# EAGLE design vertical_farming (EAGLE 9.6.2)
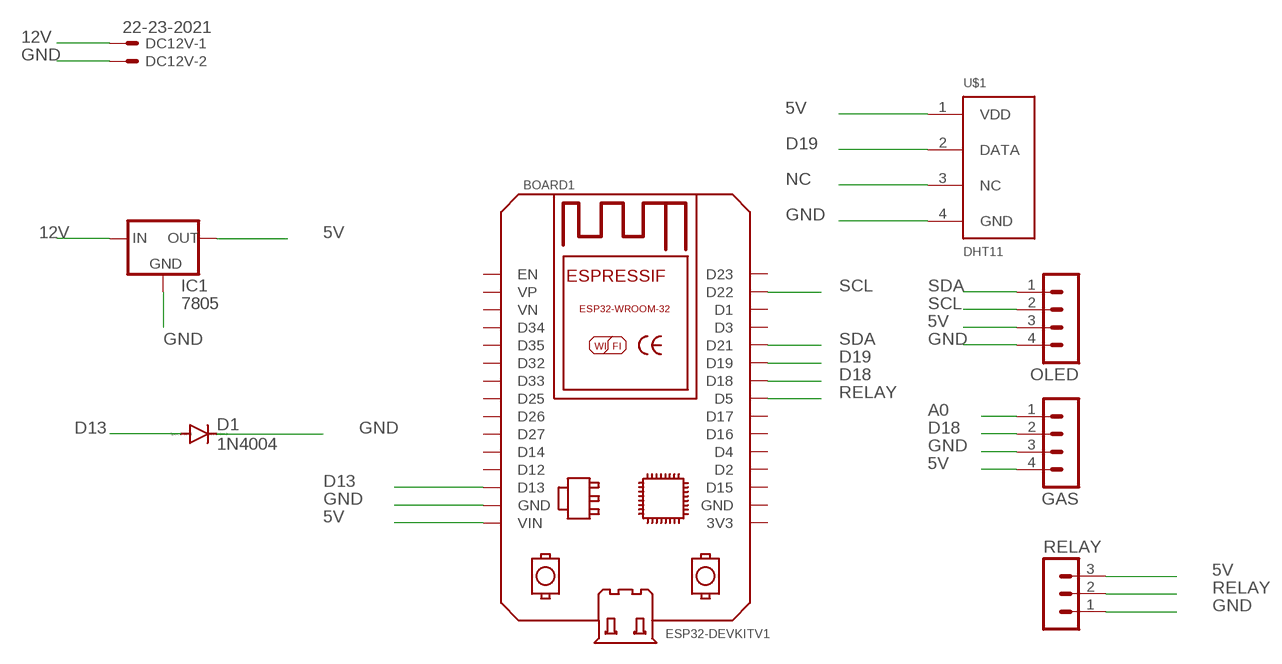
[diagram p0: schematic, sheet 1]

## Parts
BOARD1  ESP32DEVKITV1  [ESP32-DEVKITV1]
D1  1N4004  [DO41-10]
DC12V  22-23-2021  [22-23-2021]
GAS  MA04-1  [MA04-1]
IC1  7805  78XXL  [78XXL]
OLED  MA04-1  [MA04-1]
RELAY  MA03-1  [MA03-1]
U$1  DHT11  [DHT11]

## Nets
5V: BOARD1.VIN GAS.4 IC1.OUT OLED.3 RELAY.3 U$1.1(VDD)
12V: DC12V.1 IC1.IN
A0: GAS.1
D13: BOARD1.D13 D1.A
D18: BOARD1.D18 GAS.2
D19: BOARD1.D19 U$1.2(DATA)
GND: BOARD1.GND D1.C DC12V.2 GAS.3 IC1.GND OLED.4 RELAY.1 U$1.4(GND)
NC: U$1.3(NC)
RELAY: BOARD1.D5 RELAY.2
SCL: BOARD1.D22 OLED.2
SDA: BOARD1.D21 OLED.1
Unconnected: BOARD1.3V3 BOARD1.D1 BOARD1.D2 BOARD1.D3 BOARD1.D4 BOARD1.D12 BOARD1.D14 BOARD1.D15 BOARD1.D16 BOARD1.D17 BOARD1.D23 BOARD1.D25 BOARD1.D26 BOARD1.D27 BOARD1.D32 BOARD1.D33 BOARD1.D34 BOARD1.D35 BOARD1.EN BOARD1.GND@1(GND) BOARD1.VN BOARD1.VP

## Library data of the parts
BOARD1 = ESP32-DEVKITV1:ESP32DEVKITV1: https://github.com/shridattdudhat
D1 = diode:1N4004: DIODE general purpose rectifier, 1 A
DC12V = con-molex:22-23-2021: .100" (2.54mm) Center Header - 2 Pin; MF: MOLEX; MPN: 22-23-2021; OC_FARNELL: 1462926; OC_NEWARK: 25C3832
GAS OLED = con-lstb:MA04-1: PIN HEADER; OC_FARNELL: unknown; OC_NEWARK: unknown
IC1 = v-reg:78XXL: VOLTAGE REGULATOR
RELAY = con-lstb:MA03-1: PIN HEADER; OC_FARNELL: unknown; OC_NEWARK: unknown
U$1 = dht:DHT11

## Board
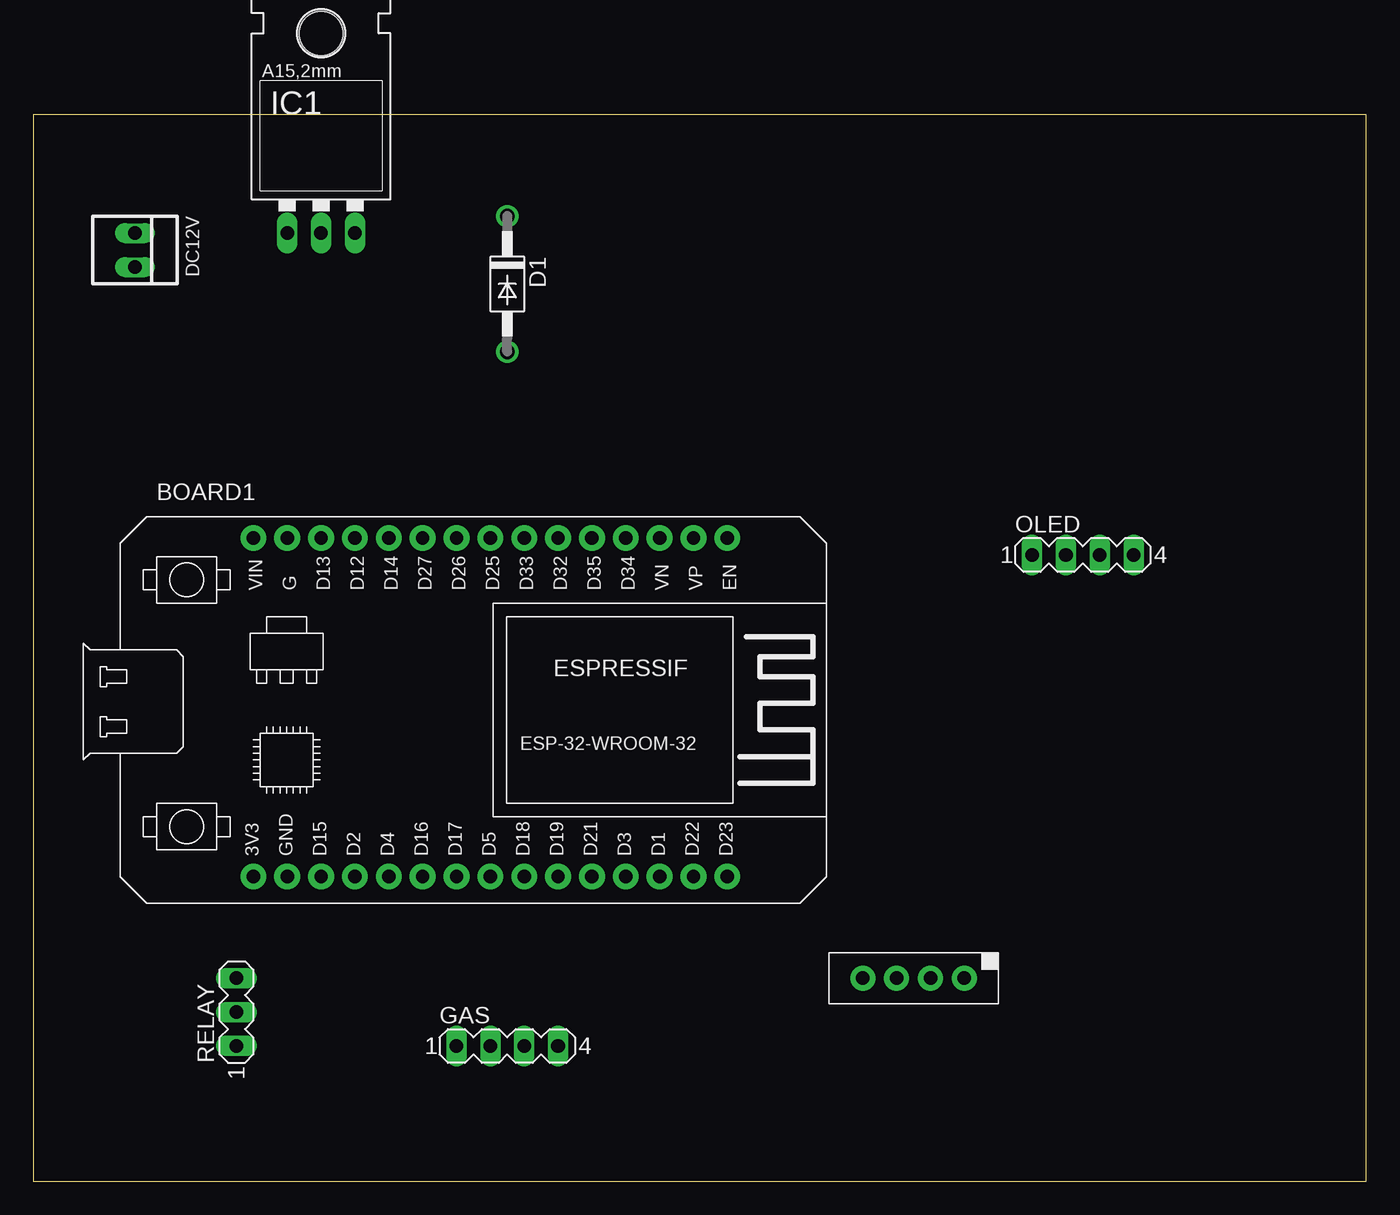
[diagram p1: board, top side]
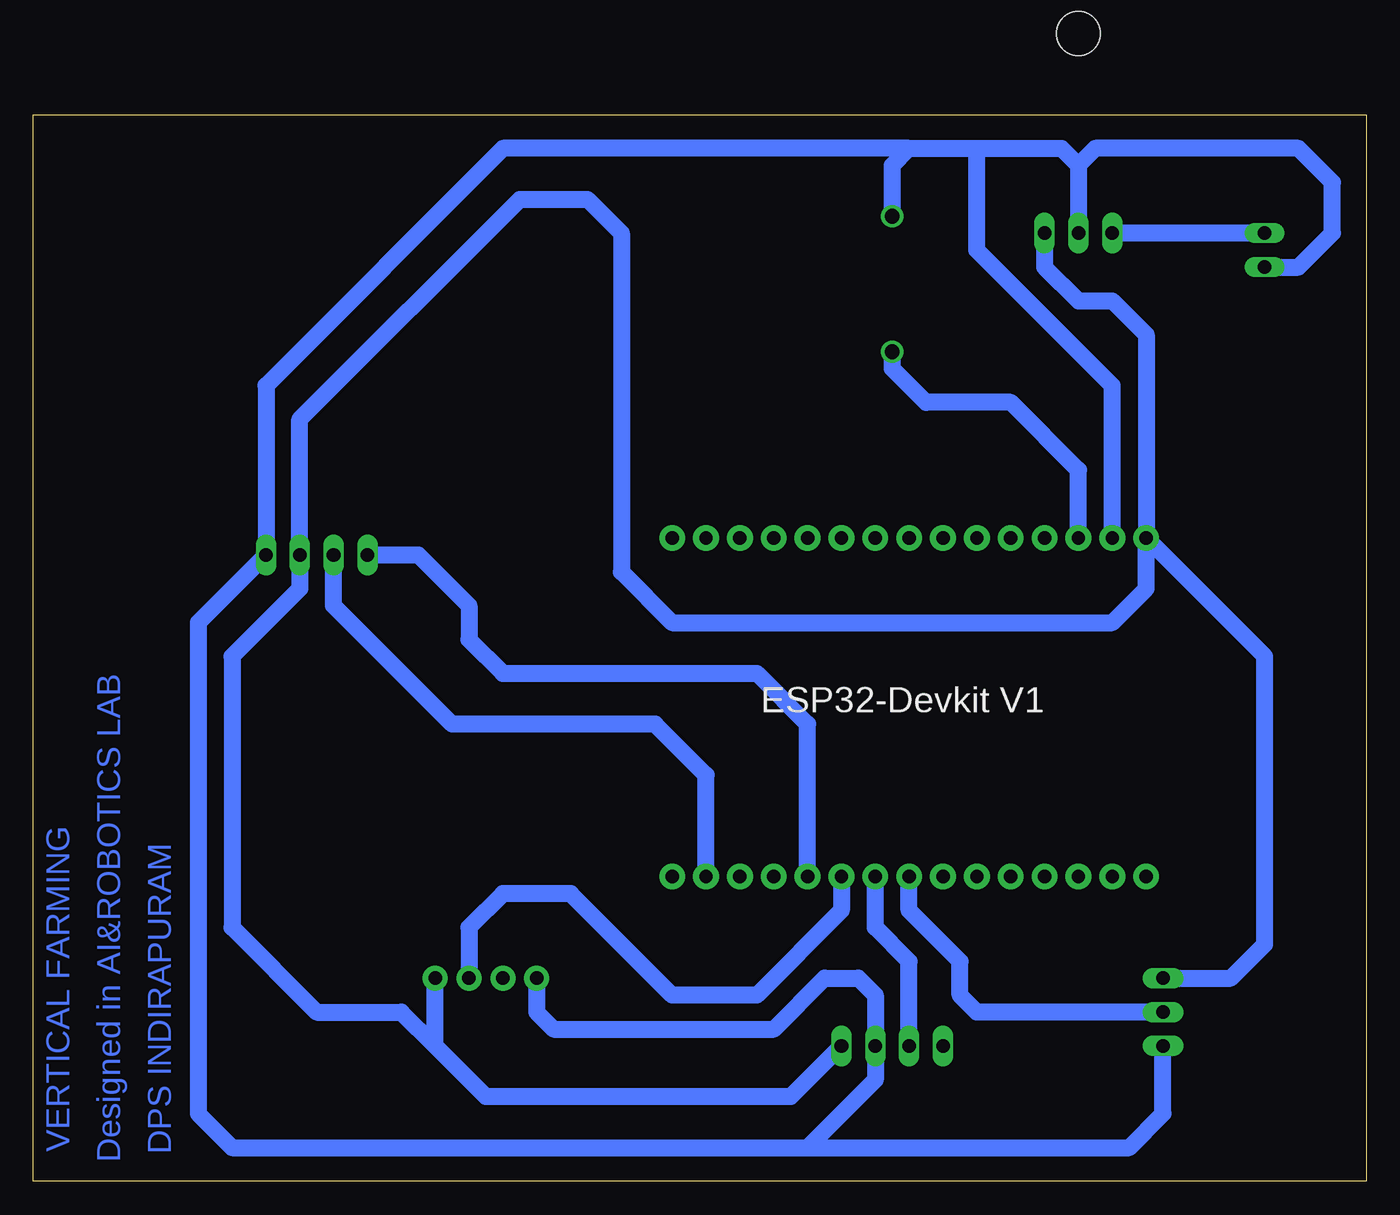
[diagram p2: board, bottom side, seen from below]

Size 100 x 80 mm. Coordinates in mm from the lower left corner, seen from the top.
Outline: 0,0 100,0 100,80 0,80 0,0
Copper layers (1*16): Top 0.035mm / dielectric 1.5mm / Bottom 0.035mm
Design rules "default": minimum track width 6mil, minimum drill 0.35mm, track to track 6mil, track to pad 6mil, pad to pad 6mil, via to via 6mil, smd to smd 6mil, copper to edge 40mil, drill to drill 6mil, minimum pad ring 10mil, minimum via ring 8mil, stop-mask expansion 4mil, vias tented up to drill 0mil, thermal gap 10mil

### Footprints (pad centres in the part's own frame; a part is rotated, then mirrored left to right if it is on the bottom)
ESP32-DEVKITV1 = drill 1 pad 1.93: 3V3 0,0; D1 30.48,0; D2 7.62,0; D3 27.94,0; D4 10.16,0; D5 17.78,0; D12 7.62,25.4; D13 5.08,25.4; D14 10.16,25.4; D15 5.08,0; D16 12.7,0; D17 15.24,0; D18 20.32,0; D19 22.86,0; D21 25.4,0; D22 33.02,0; D23 35.56,0; D25 17.78,25.4; D26 15.24,25.4; D27 12.7,25.4; D32 22.86,25.4; D33 20.32,25.4; D34 27.94,25.4; D35 25.4,25.4; EN 35.56,25.4; GND 2.54,25.4; GND@1 2.54,0; VIN 0,25.4; VN 30.48,25.4; VP 33.02,25.4
DO41-10 = drill 1.118: A 5.08,0; C -5.08,0
22-23-2021 = drill 1 long: 1 -1.27,0; 2 1.27,0
MA04-1 = drill 1.016 long: 1 -3.81,0; 2 -1.27,0; 3 1.27,0; 4 3.81,0
78XXL = drill 1.016 long: GND 0,-3.81; IN -2.54,-3.81; OUT 2.54,-3.81 | hole 3.302: 0,11.176
MA03-1 = drill 1.016 long: 1 -2.54,0; 2 0,0; 3 2.54,0
DHT11 = drill 1.016 pad 1.88: 1 -3.81,0; 2 -1.27,0; 3 1.27,0; 4 3.81,0

### Placement (x,y rotation side)
BOARD1  16.51,22.86 0 top
D1  35.56,67.31 270 top
DC12V  7.62,69.85 270 top
GAS  35.56,10.16 0 top
IC1  21.59,74.93 0 top
OLED  78.74,46.99 0 top
RELAY  15.24,12.7 90 top
U$1  66.04,15.24 180 top

### Tracks (layer width: path | path; a pad name or v marks a point on that pad's centre or on a via)
5V
  Bottom 1.27: IC1.OUT 24.13,68.58 21.59,66.04 19.05,66.04 16.51,63.5 BOARD1.VIN | BOARD1.VIN 7.62,39.37 7.62,17.78 10.16,15.24 RELAY.3 | BOARD1.VIN 16.51,44.45 19.05,41.91 52.07,41.91 55.88,45.72 55.88,71.12 58.42,73.66 63.5,73.66 80.01,57.15 OLED.3 80.01,44.45 85.09,39.37 85.09,19.05 78.74,12.7 72.39,12.7 69.85,10.16 | GAS.4 43.18,6.35 66.04,6.35 69.22,9.53 69.85,10.16 | 69.85,10.16 U$1.1
12V
  Bottom 1.27: DC12V.1 IC1.IN
D13
  Bottom 1.27: BOARD1.D13 21.59,53.34 26.67,58.42 33.02,58.42 35.56,60.96 D1.A
D18
  Bottom 1.27: GAS.2 34.29,16.51 36.83,19.05 BOARD1.D18
D19
  Bottom 1.27: BOARD1.D19 39.37,20.32 45.72,13.97 52.07,13.97 59.69,21.59 64.77,21.59 67.31,19.05 U$1.2
GND
  Bottom 1.27: D1.C 35.56,76.2 34.29,77.47 | 21.59,76.2 22.86,77.47 29.21,77.47 | 21.59,76.2 IC1.GND | 34.29,77.47 29.21,77.47 | DC12V.2 5.08,68.58 2.54,71.12 2.54,74.93 5.08,77.47 20.32,77.47 21.59,76.2 | BOARD1.GND 19.05,59.69 29.21,69.85 29.21,77.47 | 41.91,2.54 17.78,2.54 15.24,5.08 RELAY.1 | 41.91,2.54 36.83,7.62 GAS.3 36.83,13.97 38.1,15.24 40.64,15.24 44.45,11.43 60.96,11.43 62.23,12.7 U$1.4 | 41.91,2.54 85.09,2.54 87.63,5.08 87.63,41.91 OLED.4 82.55,59.69 64.77,77.47 34.29,77.47
RELAY
  Bottom 1.27: RELAY.2 29.21,12.7 30.48,13.97 30.48,16.51 34.29,20.32 BOARD1.D5
SCL
  Bottom 1.27: BOARD1.D22 49.53,30.48 53.34,34.29 68.58,34.29 77.47,43.18 OLED.2
SDA
  Bottom 1.27: BOARD1.D21 41.91,34.29 45.72,38.1 64.77,38.1 67.31,40.64 67.31,43.18 71.12,46.99 OLED.1

### Text on the board
Bottom: Designed in AI&ROBOTICS LAB | VERTICAL FARMING | DPS INDIRAPURAM